# Altium schematic sheet main.SchDoc
size A4
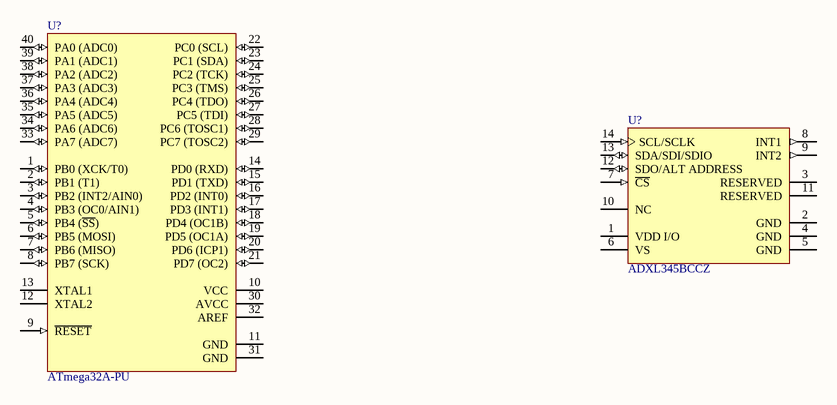
[diagram p0: main.SchDoc]

## Parts
(Parts that share a designator on the sheet are numbered #1, #2 ... from top to bottom, then left to right.)
U?#1  ATmega32A-PU  [40P6]
U?#2  ADXL345BCCZ  [ADI-CC-14-1_V]

## Nets

Not connected (* = marked no-connect by the designer): U?#1 1(PB0_(XCK/T0)) 2(PB1_(T1)) 3(PB2_(INT2/AIN0)) 4(PB3_(OC0/AIN1)) 5(PB4_(~{SS})) 6(PB5_(MOSI)) 7(PB6_(MISO)) 8(PB7_(SCK)) 9(~{RESET}) 10(VCC) 11(GND) 12(XTAL2) 13(XTAL1) 14(PD0_(RXD)) 15(PD1_(TXD)) 16(PD2_(INT0)) 17(PD3_(INT1)) 18(PD4_(OC1B)) 19(PD5_(OC1A)) 20(PD6_(ICP1)) 21(PD7_(OC2)) 22(PC0_(SCL)) 23(PC1_(SDA)) 24(PC2_(TCK)) 25(PC3_(TMS)) 26(PC4_(TDO)) 27(PC5_(TDI)) 28(PC6_(TOSC1)) 29(PC7_(TOSC2)) 30(AVCC) 31(GND) 32(AREF) 33(PA7_(ADC7)) 34(PA6_(ADC6)) 35(PA5_(ADC5)) 36(PA4_(ADC4)) 37(PA3_(ADC3)) 38(PA2_(ADC2)) 39(PA1_(ADC1)) 40(PA0_(ADC0)); U?#2 1(VDD_I/O) 2(GND) 3(RESERVED) 4(GND) 5(GND) 6(VS) 7(~{CS}) 8(INT1) 9(INT2) 10(NC) 11(RESERVED) 12(SDO/ALT_ADDRESS) 13(SDA/SDI/SDIO) 14(SCL/SCLK)

## Library data of the parts
U?#1 = ATmega32A-PU: 8-bit AVR Microcontroller, 2.7-5.5V, 16MHz, 32KB Flash, 1KB EEPROM, 2KB SRAM, 40-pin PDIP, Industrial Grade (-40°C to 85°C); DatasheetVersion: revC, Feb-2011; PackageVersion: revB, Sep-2001; PackageReference: 40P6; PackageDescription: 40-lead (0.600"/15.24mm Wide) Plastic Dual Inline Package (PDIP); Code_JEDEC: MS-011-AC; ComponentLink1Description: Manufacturer URL; ComponentLink1URL: http://www.atmel.com/; ComponentLink2Description: ATmega32A Datasheet; ComponentLink2URL: http://www.atmel.com/dyn/resources/prod_documents/doc8155.pdf; ComponentLink3Description: ATmega32A Summary; ComponentLink3URL: http://www.atmel.com/dyn/resources/prod_documents/8155S.pdf
U?#2 = ADXL345BCCZ: 3-Axis, +/-2 g / +/-4 g / +/-8 g / +/-16 g Digital Accelerometer with Digital Output, 1.6 KHz BW, Industrial, 14-pin LGA, Tray; Manufacturer: Analog Devices; # of Axes: 3; -3dB Bandwidth: 1.6 KHz; Sensitivity: 256/128/64/32 LSB/g; Supply Current: 140 uA; Voltage Supply (V): 2.0 to 3.6; DatasheetVersion: Rev. D; PackageVersion: 03-16-2010-A, 03/2010; PackageReference: CC-14-1; PackageDescription: 14-Pin Land Grid Array, 3 x 5 mm Body, 0.8 mm Pitch; Supplier 1: Digi-Key; Supplier Part Number 1: ADXL345BCCZ-ND; Supplier 2: Farnell; Supplier Part Number 2: 1853935; Supplier 3: Newark; Supplier Part Number 3: 04R8114; Supplier 4: Mouser; Supplier Part Number 4: 584-ADXL345BCCZ; Output Type: Digital; Packing: Tray; Mounting Technology: Surface Mount; PartNumber: ADXL345BCCZ; ComponentLink1Description: Manufacturer URL; ComponentLink1URL: http://www.analog.com/en/index.html; ComponentLink2Description: Datasheet; ComponentLink2URL: http://www.analog.com/static/imported-files/data_sheets/ADXL345.pdf; ComponentLink3Description: Package Specification; ComponentLink3URL: http://www.analog.com/static/imported-files/data_sheets/ADXL343.pdf; ComponentLink4Description: Product URL; ComponentLink4URL: http://www.analog.com/en/mems-sensors/mems-inertial-sensors/adxl345/products/product.html